# EAGLE design controller17 (EAGLE 9.5.2)

## Sheet 1 of 2
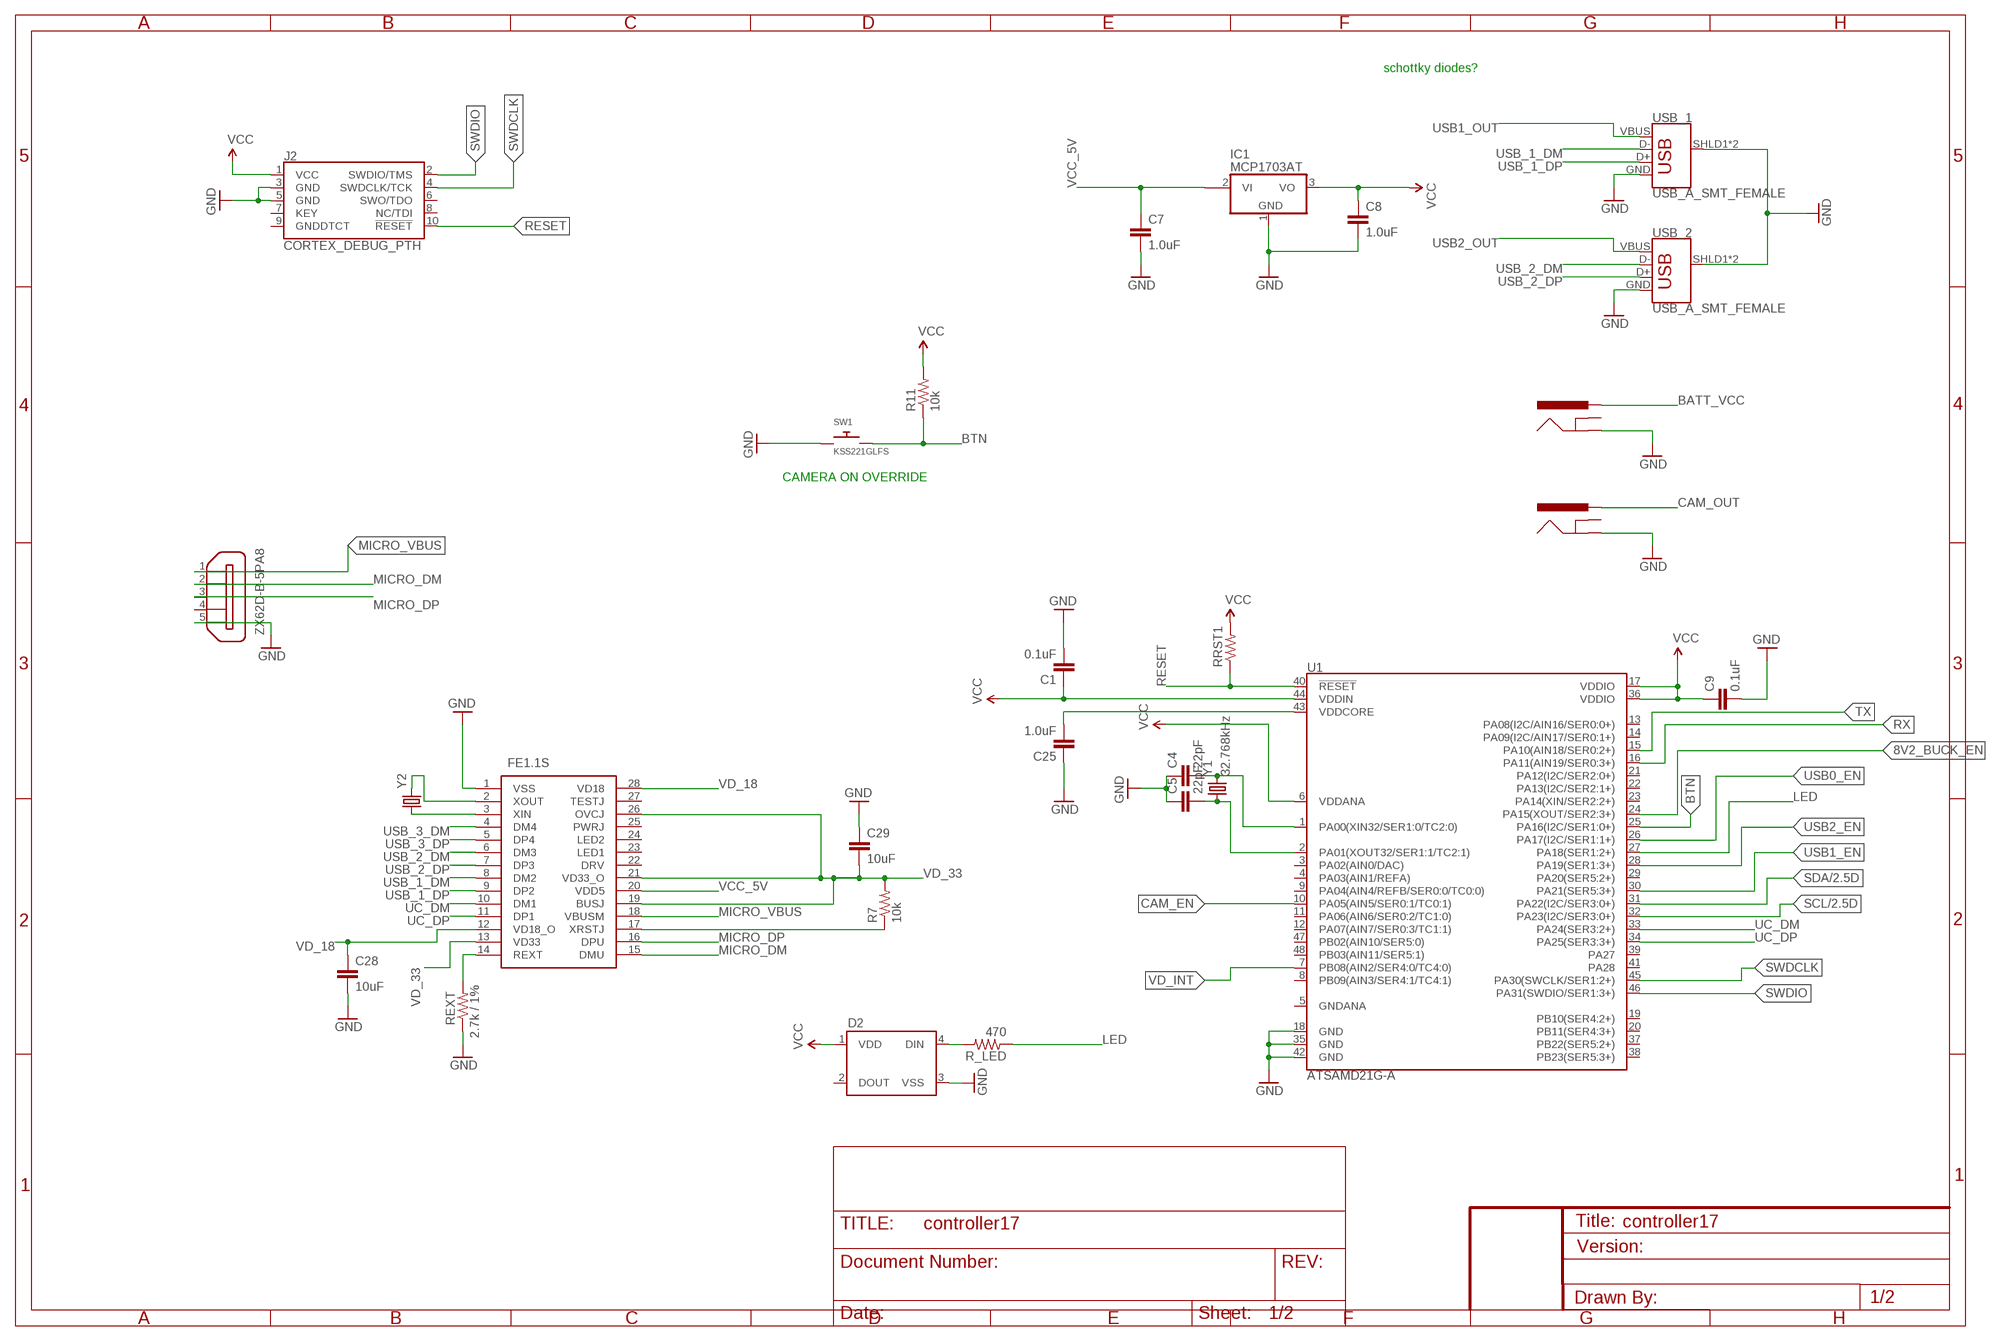
[diagram p0: schematic, sheet 1]

### Parts
C1  0.1uF  1.0UF-0805-25V-10%  [0805]
C4  22pF  CAP0805  [0805]
C5  22pF  CAP0805  [0805]
C7  1.0uF  1.0UF-0805-25V-10%  [0805]
C8  1.0uF  1.0UF-1206-50V-10%  [1206]
C9  0.1uF  1.0UF-0805-25V-10%  [0805]
C25  1.0uF  1.0UF-0805-25V-10%  [0805]
C28  10uF  1.0UF-0805-25V-10%  [0805]
C29  10uF  1.0UF-0805-25V-10%  [0805]
D2  WS2812B  [WS2812B]
IC1  MCP1703AT  MCP170312MB  [SOT89]
IC3  FE1.1S  [SOP64P600X175-28N]
J2  CORTEX_DEBUG_PTH  [2X5-PTH-1.27MM]
J3  POWER_JACKPTH_BREAD  [POWER_JACK_PTH_BREAD]
J4  POWER_JACKPTH_BREAD  [POWER_JACK_PTH_BREAD]
R7  10k  RESISTOR0805-RES  [0805]
R11  10k  RESISTOR0805-RES  [0805]
R_LED  470  RESISTOR0805-RES  [0805]
REXT  2.7k / 1%  RESISTOR0805-RES  [0805]
RRST1  RESISTOR0805-RES  [0805]
SW1  KSS221GLFS  SWITCH_PUSHBUTTONC&K_KSS  [BTN_CK_KSS]
U1  ATSAMD21G-A  [TQFP-48]
USB_1  USB_A_SMT_FEMALE  [USB-A-S-SILK-FEMALE]
USB_2  USB_A_SMT_FEMALE  [USB-A-S-SILK-FEMALE]
X2  ZX62D-B-5PA8  [ZX62D-B-5PA8]
Y1  32.768kHz  CRYSTAL3.2X1.5MM  [CRYSTAL-SMD-3.2X1.5MM]
Y2  12MHz  CRYSTALCRYSTAL-SMD-5X3-12MHZ  [CRYSTAL-SMD-5X3]

### Nets
8V2_BUCK_EN: U1.24(PA15(XOUT/SER2:3+)) ; also sheet 2
BATT_VCC [hub_power]: J4.PWR ; also sheet 2
BTN: R11.1 SW1.P$2 U1.25(PA16(I2C/SER1:0+))
CAM_EN: U1.10(PA05(AIN5/SER0:1/TC0:1)) ; also sheet 2
CAM_OUT [power]: J3.PWR ; also sheet 2
GND: C1.2 C4.1 C5.1 C7.2 C8.2 C9.2 C25.1 C28.2 C29.1 D2.3(VSS) IC1.1(GND) IC3.1(VSS) J2.3(GND) J2.5(GND) J3.GND J4.GND REXT.1 SW1.P$1 U1.18(GND) U1.35(GND) U1.42(GND) USB_1.GND USB_1.SHLD1(SHIELD) USB_1.SHLD2(SHIELD) USB_2.GND USB_2.SHLD1(SHIELD) USB_2.SHLD2(SHIELD) X2.5 ; also sheet 2
LED: R_LED.1 U1.27(PA18(SER1:2+))
MICRO_DM: IC3.15(DMU) X2.2
MICRO_DP: IC3.16(DPU) X2.3
MICRO_VBUS: IC3.18(VBUSM) X2.1 ; also sheet 2
N$5: C25.2 U1.43(VDDCORE)
N$7: D2.4(DIN) R_LED.2
N$8: C4.2 U1.1(PA00(XIN32/SER1:0/TC2:0)) Y1.P$2
N$15: IC3.17(XRSTJ) R7.1
N$23: IC3.3(XIN) Y2.1
N$24: IC3.2(XOUT) Y2.3
N$31: IC3.14(REXT) REXT.2
N$32: C5.2 U1.2(PA01(XOUT32/SER1:1/TC2:1)) Y1.P$1
RESET: J2.10(!RESET) RRST1.1 U1.40(!RESET!)
RX: U1.16(PA11(AIN19/SER0:3+))
SCL: U1.32(PA23(I2C/SER3:0+)) ; also sheet 2
SDA: U1.31(PA22(I2C/SER3:0+)) ; also sheet 2
SWDCLK: J2.4(SWDCLK/TCK) U1.45(PA30(SWCLK/SER1:2+))
SWDIO: J2.2(SWDIO/TMS) U1.46(PA31(SWDIO/SER1:3+))
TX: U1.15(PA10(AIN18/SER0:2+))
UC_DM: IC3.10(DM1) U1.33(PA24(SER3:2+))
UC_DP: IC3.11(DP1) U1.34(PA25(SER3:3+))
USB0_EN: U1.26(PA17(I2C/SER1:1+)) ; also sheet 2
USB1_EN: U1.30(PA21(SER5:3+)) ; also sheet 2
USB1_OUT: USB_1.VBUS ; also sheet 2
USB2_EN: U1.28(PA19(SER1:3+)) ; also sheet 2
USB2_OUT: USB_2.VBUS ; also sheet 2
USB_1_DM: IC3.8(DM2) USB_1.D-
USB_1_DP: IC3.9(DP2) USB_1.D+
USB_2_DM: IC3.6(DM3) USB_2.D-
USB_2_DP: IC3.7(DP3) USB_2.D+
USB_3_DM: IC3.4(DM4)
USB_3_DP: IC3.5(DP4)
VCC [power]: C1.1 C8.1 C9.1 D2.1(VDD) IC1.3(VO) J2.1(VCC) R11.2 RRST1.2 U1.6(VDDANA) U1.17(VDDIO) U1.36(VDDIO) U1.44(VDDIN) ; also sheet 2
VCC_5V [power]: C7.1 IC1.2@1(VI1) IC3.20(VDD5) ; also sheet 2
VD_18: C28.1 IC3.12(VD18_O) IC3.28(VD18)
VD_33: C29.2 IC3.13(VD33) IC3.19(BUSJ) IC3.21(VD33_O) IC3.26(OVCJ) R7.2
VD_INT: U1.7(PB08(AIN2/SER4:0/TC4:0)) ; also sheet 2
Unconnected: D2.2(DOUT) IC1.2(VI) IC3.22(DRV) IC3.23(LED1) IC3.24(LED2) IC3.25(PWRJ) IC3.27(TESTJ) J2.6(SWO/TDO) J2.7(KEY) J2.8(NC/TDI) J2.9(GNDDTCT) J3.GNDBREAK J4.GNDBREAK U1.3(PA02(AIN0/DAC)) U1.4(PA03(AIN1/REFA)) U1.5(GNDANA) U1.8(PB09(AIN3/SER4:1/TC4:1)) U1.9(PA04(AIN4/REFB/SER0:0/TC0:0)) U1.11(PA06(AIN6/SER0:2/TC1:0)) U1.12(PA07(AIN7/SER0:3/TC1:1)) U1.13(PA08(I2C/AIN16/SER0:0+)) U1.14(PA09(I2C/AIN17/SER0:1+)) U1.19(PB10(SER4:2+)) U1.20(PB11(SER4:3+)) U1.21(PA12(I2C/SER2:0+)) U1.22(PA13(I2C/SER2:1+)) U1.23(PA14(XIN/SER2:2+)) U1.29(PA20(SER5:2+)) U1.37(PB22(SER5:2+)) U1.38(PB23(SER5:3+)) U1.39(PA27) U1.41(PA28) U1.47(PB02(AIN10/SER5:0)) U1.48(PB03(AIN11/SER5:1)) X2.4 X2.S1 X2.S2 X2.S3 X2.S4

### Notes on the sheet
- schottky diodes?
- CAMERA ON OVERRIDE

## Sheet 2 of 2
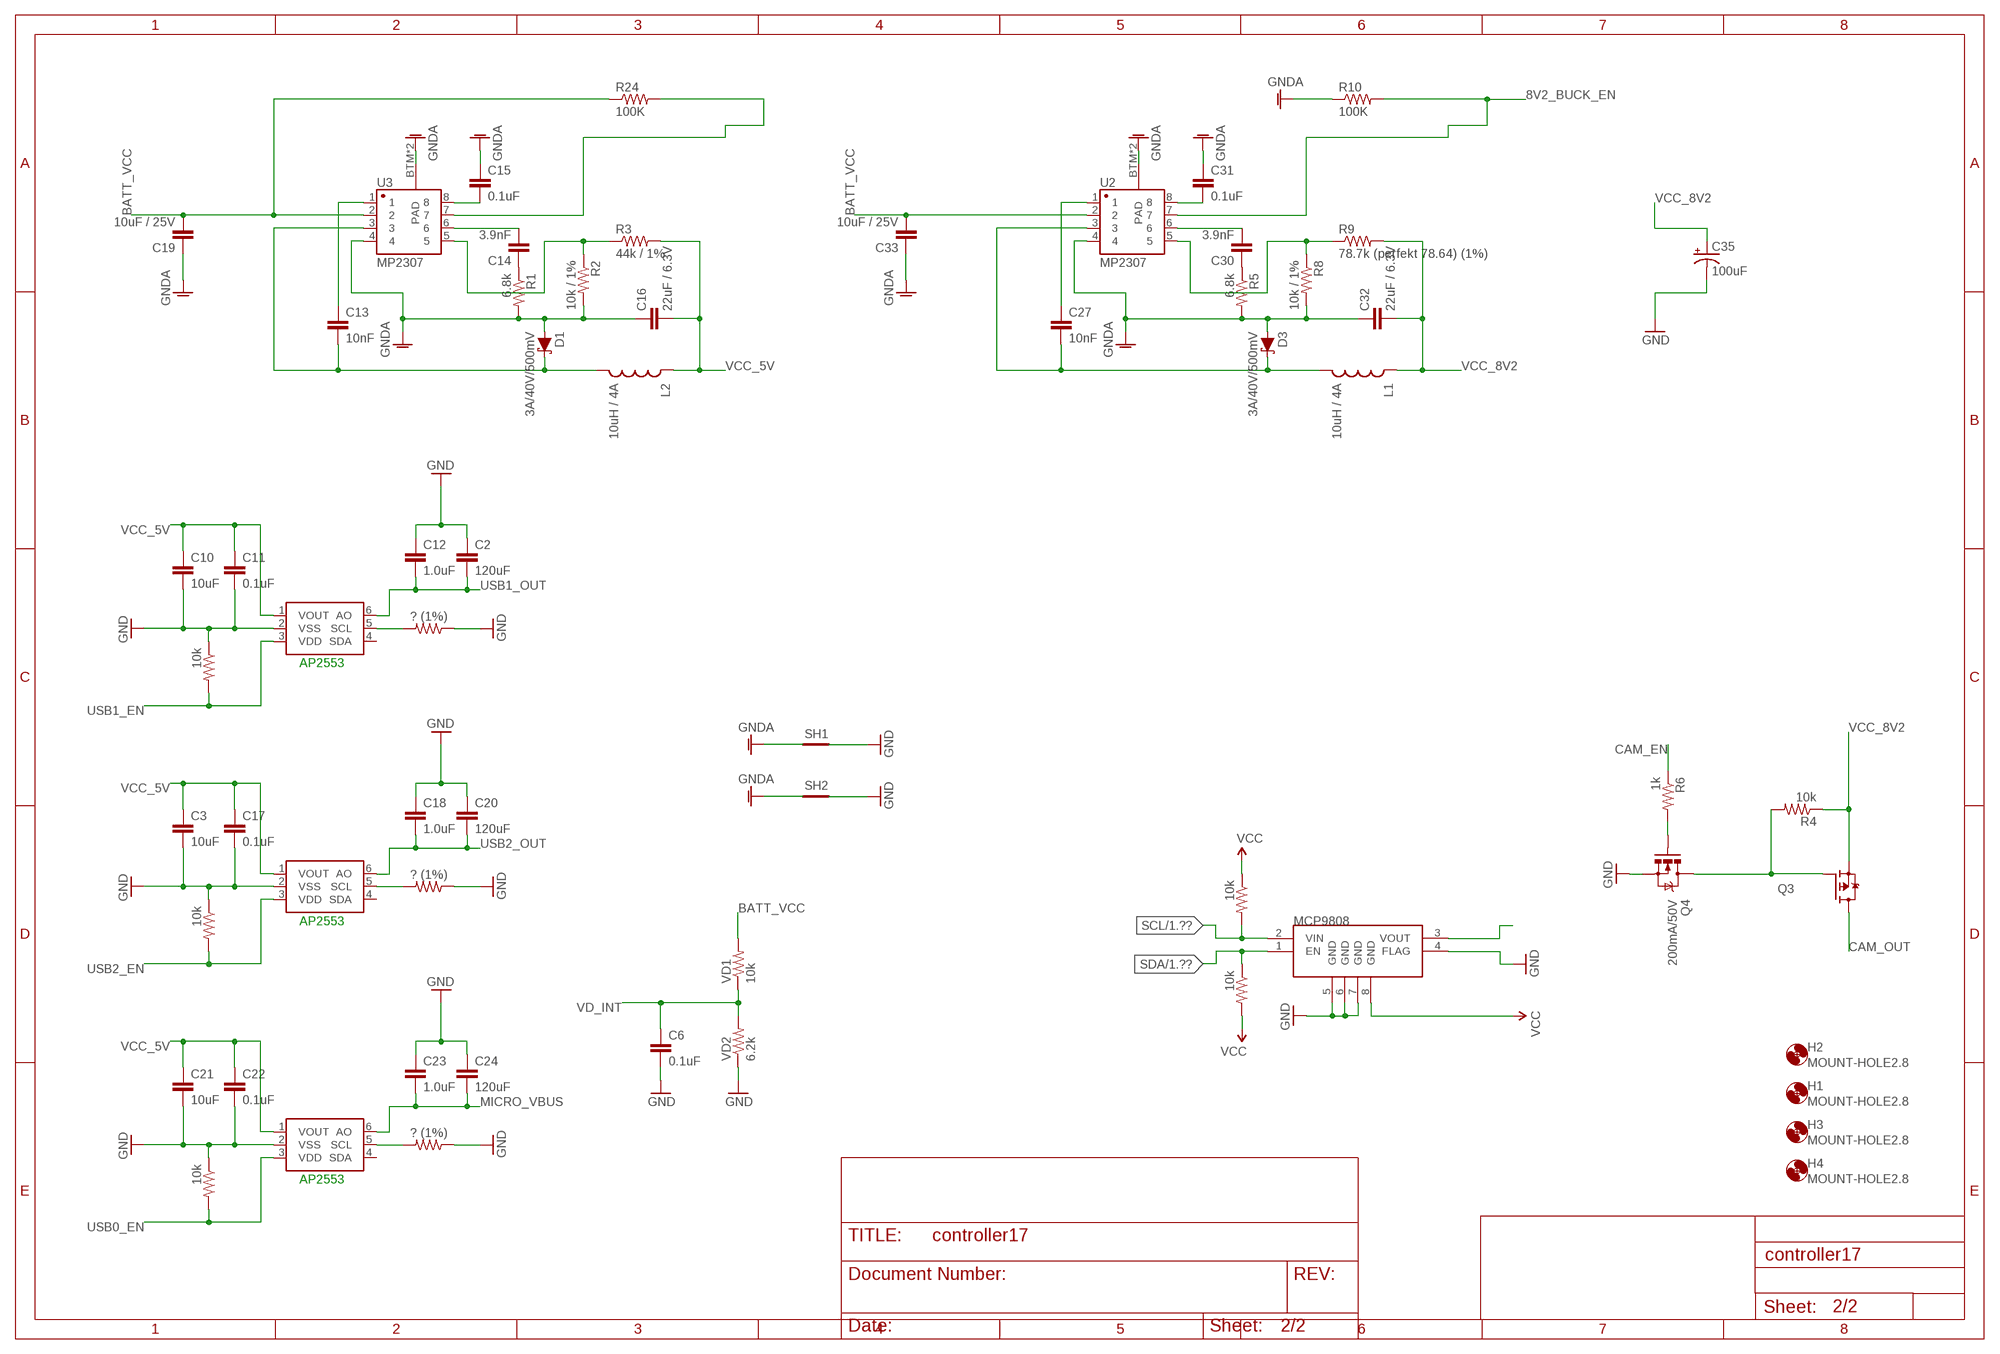
[diagram p1: schematic, sheet 2]

### Parts
AP1  MCP4725  MCP4725SOT-23  [SOT23-6]
AP2  MCP4725  MCP4725SOT-23  [SOT23-6]
AP2553  MCP4725  MCP4725SOT-23  [SOT23-6]
C2  120uF  1.0UF-1206-50V-10%  [1206]
C3  10uF  1.0UF-1206-50V-10%  [1206]
C6  0.1uF  CAP1206  [1206]
C10  10uF  1.0UF-1206-50V-10%  [1206]
C11  0.1uF  1.0UF-0805-25V-10%  [0805]
C12  1.0uF  1.0UF-0805-25V-10%  [0805]
C13  10nF  CAP1206  [1206]
C14  3.9nF  CAP1206  [1206]
C15  0.1uF  CAP1206  [1206]
C16  22uF / 6.3V  CAP1210  [1210]
C17  0.1uF  1.0UF-0805-25V-10%  [0805]
C18  1.0uF  1.0UF-1206-50V-10%  [1206]
C19  10uF / 25V  CAP1210  [1210]
C20  120uF  1.0UF-1206-50V-10%  [1206]
C21  10uF  1.0UF-1206-50V-10%  [1206]
C22  0.1uF  1.0UF-0805-25V-10%  [0805]
C23  1.0uF  1.0UF-1206-50V-10%  [1206]
C24  120uF  1.0UF-1206-50V-10%  [1206]
C27  10nF  CAP1206  [1206]
C30  3.9nF  CAP1206  [1206]
C31  0.1uF  CAP1206  [1206]
C32  22uF / 6.3V  CAP1210  [1210]
C33  10uF / 25V  CAP1210  [1210]
C35  100uF  100UF-POLAR-25V-20%(ELEC)  [PANASONIC_D]
D1  3A/40V/500mV  DIODE-SCHOTTKY-B340A  [SMA-DIODE]
D3  3A/40V/500mV  DIODE-SCHOTTKY-B340A  [SMA-DIODE]
H1  MOUNT-HOLE2.8  [2,8]
H2  MOUNT-HOLE2.8  [2,8]
H3  MOUNT-HOLE2.8  [2,8]
H4  MOUNT-HOLE2.8  [2,8]
L1  10uH / 4A  INDUCTORSRU1038  [SRU1038]
L2  10uH / 4A  INDUCTORSRU1038  [SRU1038]
MCP9808  V_REG_MIC5216  [MSOP8]
Q3  FDD4141TO252  [TO252]
Q4  200mA/50V  MOSFET-NCHANNELBSS138  [SOT23-3]
R1  6.8k  RESISTOR1206  [1206]
R2  10k / 1%  RESISTOR1206  [1206]
R3  44k / 1%  RESISTOR1206  [1206]
R4  10k  RESISTOR0805-RES  [0805]
R5  6.8k  RESISTOR1206  [1206]
R6  1k  RESISTOR0805-RES  [0805]
R8  10k / 1%  RESISTOR1206  [1206]
R9  78.7k (perfekt 78.64) (1%)  RESISTOR1206  [1206]
R10  100K  RESISTOR1206  [1206]
R24  100K  RESISTOR1206  [1206]
R_I2C_1  10k  RESISTOR0805-RES  [0805]
R_I2C_2  10k  RESISTOR0805-RES  [0805]
R_MOSFET_USB1  ? (1%)  RESISTOR0805-RES  [0805]
R_MOSFET_USB2  ? (1%)  RESISTOR0805-RES  [0805]
R_MOSFET_USB3  10k  RESISTOR0805-RES  [0805]
R_MOSFET_USB4  10k  RESISTOR0805-RES  [0805]
R_MOSFET_USB5  ? (1%)  RESISTOR0805-RES  [0805]
R_MOSFET_USB6  10k  RESISTOR0805-RES  [0805]
SH1  SHORT-HT5  [SHORT_TOP-50]
SH2  SHORT-HT5  [SHORT_TOP-50]
U2  MP2307  GENERIC-SOIC8MSGEQ7N-FILTER  [SO08]
U3  MP2307  GENERIC-SOIC8MSGEQ7N-FILTER  [SO08]
VD1  10k  RESISTOR1206  [1206]
VD2  6.2k  RESISTOR1206  [1206]

### Nets
8V2_BUCK_EN: R10.2 U2.7 ; also sheet 1
BATT_VCC [hub_power]: C19.2 C33.2 R24.1 U2.2 U3.2 VD1.2 ; also sheet 1
CAM_EN: R6.1 ; also sheet 1
CAM_OUT [power]: Q3.3(D) ; also sheet 1
GND: AP1.2(VSS) AP2.2(VSS) AP2553.2(VSS) C2.1 C3.2 C6.2 C10.2 C11.2 C12.1 C17.2 C18.1 C20.1 C21.2 C22.2 C23.1 C24.1 C35.- MCP9808.4(FLAG) MCP9808.5(GND) MCP9808.6(GND) MCP9808.7(GND) Q4.2(S) R_MOSFET_USB1.1 R_MOSFET_USB2.1 R_MOSFET_USB3.1 R_MOSFET_USB4.1 R_MOSFET_USB5.1 R_MOSFET_USB6.1 SH1.2 SH2.2 VD2.1 ; also sheet 1
GNDA [power]: C15.1 C16.1 C19.1 C31.1 C32.1 C33.1 D1.A D3.A R1.2 R2.2 R5.2 R8.2 R10.1 SH1.1 SH2.1 U2.4 U2.BTM(PAD) U2.P$1(PAD) U3.4 U3.BTM(PAD) U3.P$1(PAD)
MICRO_VBUS: AP2.6(AO) C23.2 C24.2 ; also sheet 1
N$1: C31.2 U2.8
N$2: Q4.1(G) R6.2
N$3: Q3.1(G) Q4.3(D) R4.2
N$4: MCP9808.3(VOUT)
N$6 [power]: C27.2 D3.C L1.2 U2.3
N$9: AP2553.5(SCL) R_MOSFET_USB1.2
N$10: AP1.5(SCL) R_MOSFET_USB2.2
N$11: AP2.5(SCL) R_MOSFET_USB5.2
N$12: C27.1 U2.1
N$13: C30.1 R5.1
N$14: C30.2 U2.6
N$16: R8.1 R9.1 U2.5
N$25: C15.2 U3.8
N$26 [power]: C13.2 D1.C L2.2 U3.3
N$27: C13.1 U3.1
N$28: C14.1 R1.1
N$29: C14.2 U3.6
N$30: R2.1 R3.1 U3.5
PB_BUCK_EN: R24.2 U3.7
SCL: MCP9808.2(VIN) R_I2C_1.2 ; also sheet 1
SDA: MCP9808.1(EN) R_I2C_2.1 ; also sheet 1
USB0_EN: AP2.3(VDD) R_MOSFET_USB6.2 ; also sheet 1
USB1_EN: AP2553.3(VDD) R_MOSFET_USB3.2 ; also sheet 1
USB1_OUT: AP2553.6(AO) C2.2 C12.2 ; also sheet 1
USB2_EN: AP1.3(VDD) R_MOSFET_USB4.2 ; also sheet 1
USB2_OUT: AP1.6(AO) C18.2 C20.2 ; also sheet 1
VCC [power]: MCP9808.8(GND) R_I2C_1.1 R_I2C_2.2 ; also sheet 1
VCC_5V [power]: AP1.1(VOUT) AP2.1(VOUT) AP2553.1(VOUT) C3.1 C10.1 C11.1 C16.2 C17.1 C21.1 C22.1 L2.1 R3.2 ; also sheet 1
VCC_8V2 [power]: C32.2 C35.+ L1.1 Q3.2(S) R4.1 R9.2
VD_INT: C6.1 VD1.1 VD2.2 ; also sheet 1
Unconnected: AP1.4(SDA) AP2.4(SDA) AP2553.4(SDA)

### Notes on the sheet
- AP2553
- AP2553
- AP2553

## Library data of the parts
AP1 AP2 AP2553 = SparkFun-IC-Conversion:MCP4725: MCP4725 DAC Microchip 12-bit I2C DAC, SOT23-6 Datasheet <https://cdn.sparkfun.com/datasheets/BreakoutBoards/MCP4725_2009.pdf> SparkFun Products SparkFun I2C DAC Breakout - MCP4725 <https://www.sparkfun.com/products/12918> (BOB-12918); PROD_ID: IC-08886
C1 C9 C11 C17 C22 C28 C29 = SparkFun-Capacitors:1.0UF: 1µF ceramic capacitors A capacitor is a passive two-terminal electrical component used to store electrical energy temporarily in an electric field.; PROD_ID: CAP-08064; VALUE: 1.0uF
C2 C3 C10 C20 C21 C24 = SparkFun-Capacitors:1.0UF: 1µF ceramic capacitors A capacitor is a passive two-terminal electrical component used to store electrical energy temporarily in an electric field.; PROD_ID: CAP-09822; VALUE: 1.0uF
C4 C5 = SparkFun-Passives:CAP: Capacitor Standard 0603 ceramic capacitor, and 0.1" leaded capacitor.
C6 C13-C16 C19 C27 C30-C33 = SparkFun-Capacitors:CAP: Capacitor Standard 0603 ceramic capacitor, and 0.1" leaded capacitor.
C7 C12 C25 = SparkFun-Capacitors:1.0UF: 1µF ceramic capacitors A capacitor is a passive two-terminal electrical component used to store electrical energy temporarily in an electric field.; PROD_ID: CAP-08064
C8 C18 C23 = SparkFun-Capacitors:1.0UF: 1µF ceramic capacitors A capacitor is a passive two-terminal electrical component used to store electrical energy temporarily in an electric field.; PROD_ID: CAP-09822
C35 = SparkFun-Capacitors:100UF-POLAR: 100µF polarized capacitors A capacitor is a passive two-terminal electrical component used to store electrical energy temporarily in an electric field.; PROD_ID: CAP-12547
D1 D3 = SparkFun-DiscreteSemi:DIODE-SCHOTTKY: Schottky diode A Schottky diode is a semiconductor diode which has a low forward voltage drop and a very fast switching action.; PROD_ID: DIO-09886
D2 = SparkFun-LED:WS2812B: WS2812B - Intelligent control LED integrated light source Technical Specifications: Power Supply Voltage (VDD): 3.5 to 5.3 V Input Voltage (VI): -0.5 to VDD+0.5 V Operating Junction Temperature (Topt): -25°C to +80°C Storage Temperature Range (Tstg): -55°C to +150°C; PROD_ID: DIO-12503
H1-H4 = holes:MOUNT-HOLE: MOUNTING HOLE with drill center marker
IC1 = linear:MCP1703*: 250 mA, 16V, Low Quiescent Current LDO Regulator Source: http://ww1.microchip.com/downloads/en/DeviceDoc/22049b.pdf
IC3 = FE1.1S:FE1.1S: USB 2.0 HIGH SPEED 4-PORT HUB CONTROLLER Source: Datasheet <https://cdn-shop.adafruit.com/product-files/2991/FE1.1s Data Sheet (Rev. 1.0).pdf>; DESCRIPTION: USB 2.0 HIGH SPEED 4-PORT HUB CONTROLLER; HEIGHT: 1.75mm; MANUFACTURER_NAME: JFD IC; MANUFACTURER_PART_NUMBER: FE1.1S
J2 = SparkFun-Connectors:CORTEX_DEBUG: Cortex Debug Connector - 10 pin Supports JTAG debug, Serial Wire debug, and Serial Wire Viewer. PTH and SMD connector options available. General Connector Information <http://infocenter.arm.com/help/topic/com.arm.doc.faqs/attached/13634/cortex_debug_connectors.pdf> Products: PTH Connector <http://www.digikey.com/product-detail/en/cnc-tech/3220-10-0100-00/1175-1627-ND/3883661> -via Digi-Key SparkFun PSoc <https://www.sparkfun.com/products/13229> SparkFun T <https://www.sparkfun.com/products/13810>
J3 J4 = SparkFun-Connectors:POWER_JACK: Power Jack Connector This is the standard 5.5mm barrel jack for power. The PTH is the most common, proven, reliable, footprint. The Slot footprint only works if the mill layer is transmitted to the PCB fab house so be warned. Here are the connectors we sell at SparkFun: DC Barrel Power Jack/Connector <https://www.sparkfun.com/products/119> (PRT-00119) DC Barrel Power Jack/Connector (SMD) <https://www.sparkfun.com/products/12748> (PRT-12748) DC Barrel Jack Adapter - Breadboard Compatible <https://www.sparkfun.com/products/10811> (PRT-10811) It is used on this SparkFun product (and many, many others): SparkFun RedBoard - Programmed with Arduino <https://www.sparkfun.com/products/12757> (DEV-12757) Also, if you need a mating power supply or connector, please check these out: Wall Adapter Power Supply - 9VDC 650mA <https://www.sparkfun.com/products/298> (TOL-00298) DC Barrel Jack Adapter - Male <https://www.sparkfun.com/products/10287> (PRT-10287); PROD_ID: PRT-10811
L1 L2 = SparkFun-Passives:INDUCTOR: Inductors Basic Inductor/Choke - 0603 and 1206. Footprints are not proven and vary greatly between part numbers. INDUCTOR POWER 3.3UH 4.0A SMD 0.197" L x 0.197" W x 0.177" H (5.00mm x 5.00mm x 4.50mm)
MCP9808 = SparkFun-IC-Power:V_REG_MIC5216: 500mA LDO, MSOP8 for better dissipation; PROD_ID: IC-09527
Q3 = transistor-fet:FDD4141: P-Channel PowerTrench® MOSFET Source: FDD4141.pdf
Q4 = SparkFun-DiscreteSemi:MOSFET-NCHANNEL: Common NMOSFET Parts MFG P/N Store ID Prod ID FDD8780 TRANS-09984 SI7820DN TRANS-11055 FDS6630A IC-08089 2N7002PW TRANS-11151 FQP30N06L COM-10213 TRANS-10060 BSS123LT1G TRANS-08345 BSS138 TRANS-00830 BS170 2N7000; PROD_ID: TRANS-00830
R1-R6 R8-R10 R24 R_LED = SparkFun-Resistors:RESISTOR: Resistor Basic schematic elements and footprints for 0603, 1206, and PTH resistors.
R7 R11 R_I2C_1 R_I2C_2 R_MOSFET_USB1-R_MOSFET_USB6 REXT RRST1 VD1 VD2 = SparkFun-Passives:RESISTOR: Resistor Basic schematic elements and footprints for 0603, 1206, and PTH resistors.
SH1 SH2 = shorts:SHORT-H: Short between two nets; BOM: no
SW1 = adafruit:SWITCH_PUSHBUTTON: Buttons SOFTTOUCHSMD_SJ - Soft touch temporary push button (Super Junk Akihabara) Compatible with SKPMANE010 [Mouser: 688-SKPMAN] C&K_KSS = Digikey: KSS221GLFS
U1 = SparkFun-IC-Microcontroller:ATSAMD21G: Atmel SAMD21G SMART ARM-Based Microcontroller The Atmel ® | SMART ™ SAM D21 is a series of low-power microcontrollers using the 32-bit ARM ® Cortex ® -M0+ processor, and ranging from 32- to 64-pins with up to 256KB Flash and 32KB of SRAM. The SAM D21 devices operate at a maximum frequency of 48MHz and reach 2.46 CoreMark/MHz. They are designed for simple and intuitive migration with identical peripheral modules, hex compatible code, identical linear address map and pin compatible migration paths between all devices in the product series. All devices include intelligent and flexible peripherals, Atmel Event System for inter-peripheral signaling, and support for capacitive touch button, slider and wheel user interfaces. Datasheet <https://cdn.sparkfun.com/datasheets/Dev/Arduino/Boards/Atmel-42181-SAM-D21_Datasheet.pdf> SparkFun Products SparkFun SAMD21 Mini Breakout <https://www.sparkfun.com/products/13664> (DEV-13664) SparkFun SAMD21 Dev Breakout <https://www.sparkfun.com/products/13672> (DEV-13672); PROD_ID: IC-13064
U2 U3 = SparkFun-AnalogIC:GENERIC-SOIC8: A placeholder for generic narrow & wide SOIC8 foorptints - used on the DIP adapter board.; PROD_ID: IC-10141
USB_1 USB_2 = SparkFun-Connectors:USB_A: USB-A Connector Male and female variants, as well as PTH and SMT variants SparkFun Products: SparkFun XBee Explorer Dongle <https://www.sparkfun.com/products/11697> PTH Male SparkFun MicroView-USB Programmer <https://www.sparkfun.com/products/12924> SMT Male SparkFun USB Type A Female Breakout <https://www.sparkfun.com/products/12700> SMT Female; PROD_ID: CONN-09520; SF_ID: PRT-09011
X2 = zx62d-b-5pa8-oshpark_10:ZX62D-B-5PA8: Micro USB Type B Connector - Standard, Shell Through Hole Source: http://www.hirose.co.jp/cataloge_hp/ed_ZX_20140804.pdf; MF: Hirose; MPN: ZX62D-B-5PA8; OC_FARNELL: 2300438; OC_NEWARK: 69W0712
Y1 = SparkFun-FreqCtrl:CRYSTAL: Various standard crystals. Proven footprints.; PROD_ID: XTAL-13062
Y2 = SparkFun-FreqCtrl:CRYSTAL: Various standard crystals. Proven footprints.; PROD_ID: XTAL-08297

## Net classes
0 default: width 0.254 mm, clearance 0.152 mm
1 power: width 0.254 mm, clearance 0.254 mm
2 hub_power: width 0.584 mm, clearance 0.254 mm
3 usbsignal: width 0.254 mm, clearance 0.203 mm
4 highpower: clearance 0.305 mm

## Board
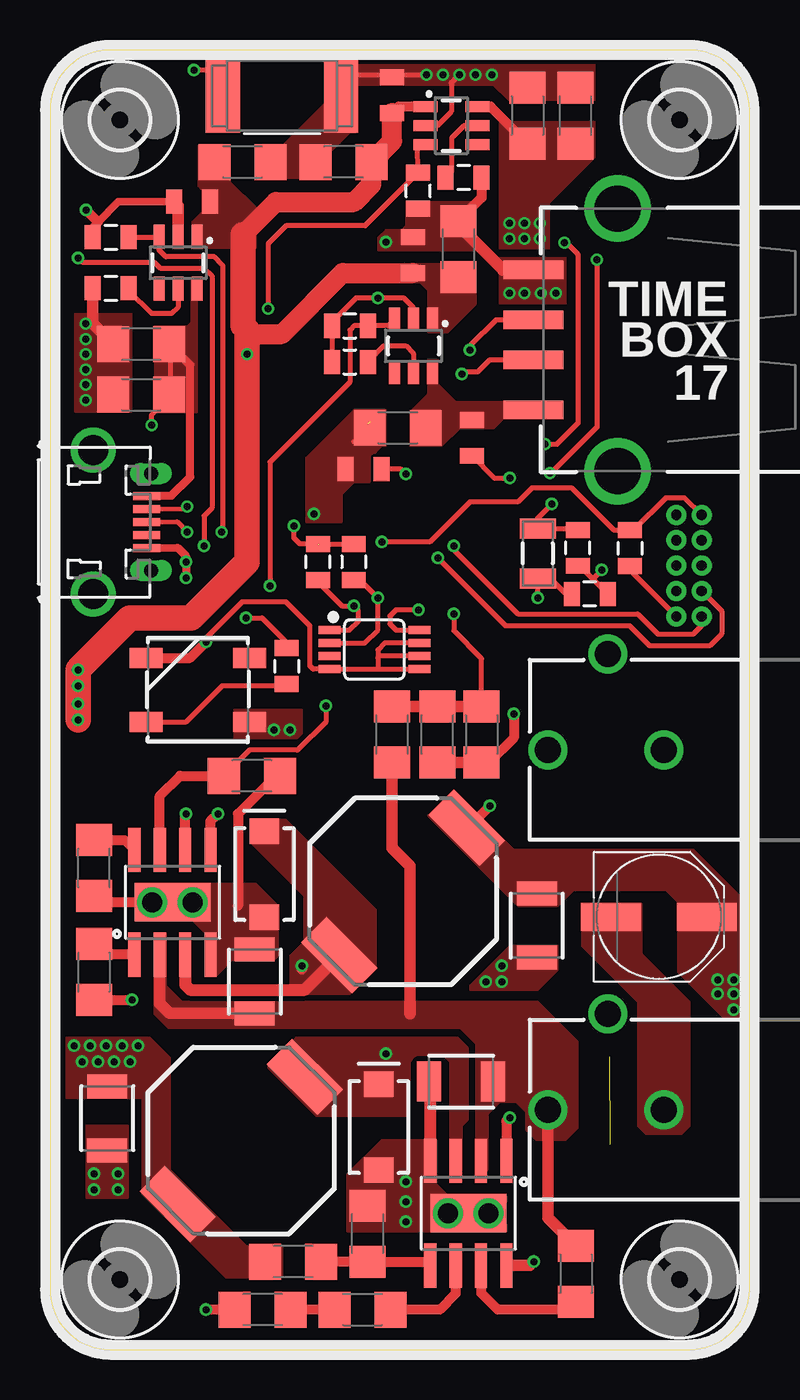
[diagram p2: board, top side]
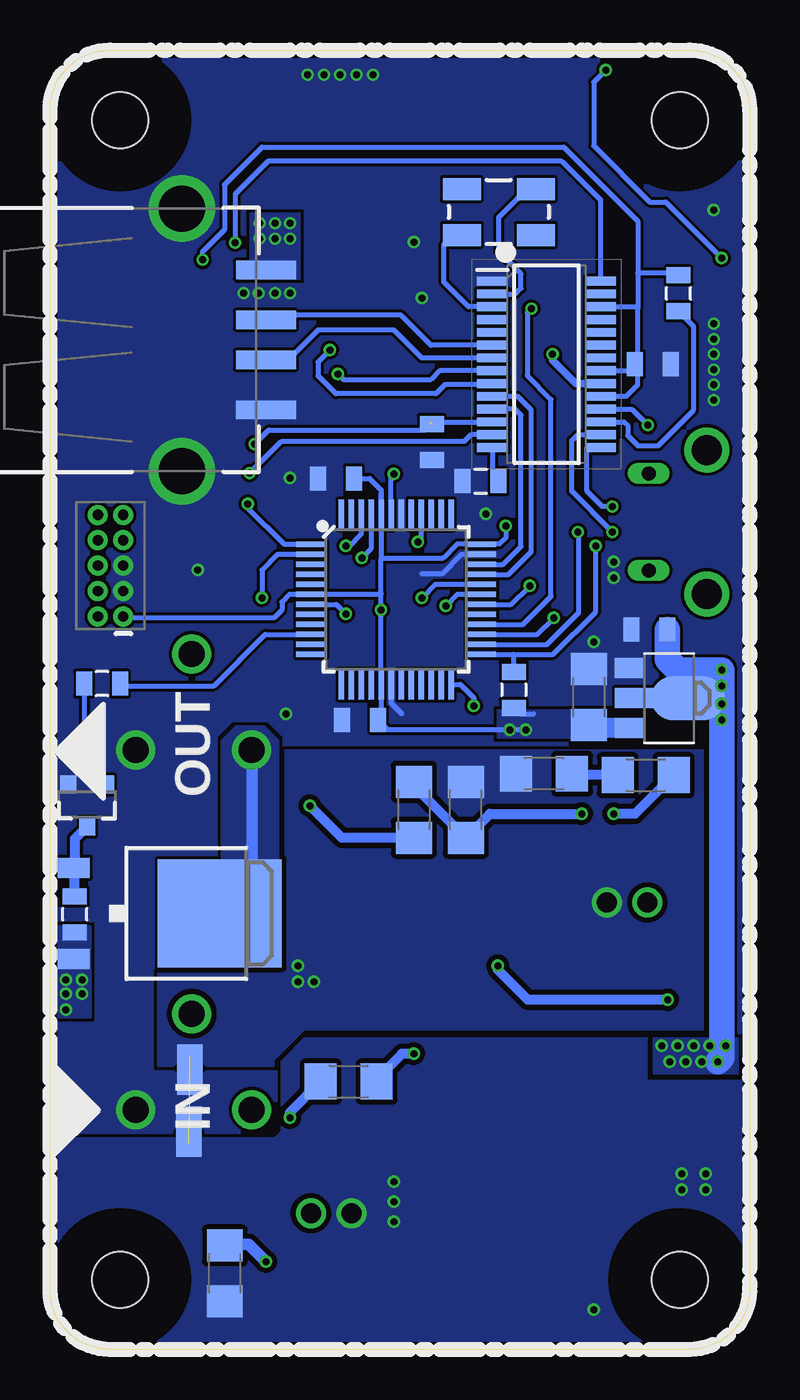
[diagram p3: board, bottom side, seen from below]

Size 35 x 65 mm. Coordinates in mm from the lower left corner, seen from the top.
Outline: 32,65 3,65 arc90 0,62 0,3 arc90 3,0 32,0 arc90 35,3 35,62 arc90 32,65
Copper layers (1*16): Top 0.035559375mm / dielectric 1.6mm / Bottom 0.035559375mm
Design rules "oshpark-2layer": minimum track width 6mil, minimum drill 10mil, track to track 6mil, track to pad 6mil, pad to pad 6mil, via to via 6mil, smd to smd 6mil, copper to edge 15mil, drill to drill 6mil, minimum pad ring 5mil, minimum via ring 5mil, stop-mask expansion 2.5mil, vias tented up to drill 0mil, thermal gap 10mil

### Footprints (pad centres in the part's own frame; a part is rotated, then mirrored left to right if it is on the bottom)
SOT23-6 = smd 0.55 x 1.2: 1 0.95,1.3; 2 0,1.3; 3 -0.95,1.3; 4 -0.95,-1.3; 5 0,-1.3; 6 0.95,-1.3
0805 = smd 0.8 x 1.2: 1 -0.9,0; 2 0.9,0
1206 = smd 1.6 x 1.8: 1 -1.4,0; 2 1.4,0
1210 = smd 1.2 x 2: 1 -1.6,0; 2 1.6,0
PANASONIC_D = smd 3 x 1.4: + 2.4,0; - -2.4,0
SMA-DIODE = smd 1.27 x 1.47: A -2.15,0; C 2.15,0
WS2812B = smd 1.651 x 1: 1 -2.577,1.6; 2 -2.577,-1.6; 3 2.577,-1.6; 4 2.577,1.6
2,8 = hole 2.8: 0,0
SOT89 = smd 1 x 1.5: 1 -1.499,-1.981; 3 1.499,-1.981 | smd 1 x 2: 2 0,-1.727 | smd 2.2 x 3.7: 2@1 0,0.94
SOP64P600X175-28N = smd 1.525 x 0.44: 1 -2.712,4.16; 2 -2.712,3.52; 3 -2.712,2.88; 4 -2.712,2.24; 5 -2.712,1.6; 6 -2.712,0.96; 7 -2.712,0.32; 8 -2.712,-0.32; 9 -2.712,-0.96; 10 -2.712,-1.6; 11 -2.712,-2.24; 12 -2.712,-2.88; 13 -2.712,-3.52; 14 -2.712,-4.16; 15 2.712,-4.16; 16 2.712,-3.52; 17 2.712,-2.88; 18 2.712,-2.24; 19 2.712,-1.6; 20 2.712,-0.96; 21 2.712,-0.32; 22 2.712,0.32; 23 2.712,0.96; 24 2.712,1.6; 25 2.712,2.24; 26 2.712,2.88; 27 2.712,3.52; 28 2.712,4.16
2X5-PTH-1.27MM = drill 0.508 pad 1: 1 -2.54,-0.635; 2 -2.54,0.635; 3 -1.27,-0.635; 4 -1.27,0.635; 5 0,-0.635; 6 0,0.635; 7 1.27,-0.635; 8 1.27,0.635; 9 2.54,-0.635; 10 2.54,0.635
POWER_JACK_PTH_BREAD = drill 1.3: GND 0,7.9; GNDBREAK 4.8,10.7; PWR 0,13.7
SRU1038 = smd 1.8 x 3.6: 1 -4.5,0; 2 4.5,0
MSOP8 = smd 0.4 x 1.1: 1 -0.975,-2.25; 2 -0.325,-2.25; 3 0.325,-2.25; 4 0.975,-2.25; 5 0.975,2.25; 6 0.325,2.25; 7 -0.325,2.25; 8 -0.975,2.25
TO252 = smd 1 x 1.6: 1 -2.28,-4.8; 2 2.28,-4.8 | smd 5.4 x 6.2: 3 0,2.5
SOT23-3 = smd 0.8 x 0.9: 1 -0.95,-1; 2 0.95,-1; 3 0,1.1
SHORT_TOP-50 = smd 1.27 x 1.27: 1 0.635,0; 2 -0.635,0
BTN_CK_KSS = smd 1.7 x 3.7: P$1 -2.95,0; P$2 2.95,0
TQFP-48 = smd 1.5 x 0.28: 1 -4.25,2.75; 2 -4.25,2.25; 3 -4.25,1.75; 4 -4.25,1.25; 5 -4.25,0.75; 6 -4.25,0.25; 7 -4.25,-0.25; 8 -4.25,-0.75; 9 -4.25,-1.25; 10 -4.25,-1.75; 11 -4.25,-2.25; 12 -4.25,-2.75; 25 4.25,-2.75; 26 4.25,-2.25; 27 4.25,-1.75; 28 4.25,-1.25; 29 4.25,-0.75; 30 4.25,-0.25; 31 4.25,0.25; 32 4.25,0.75; 33 4.25,1.25; 34 4.25,1.75; 35 4.25,2.25; 36 4.25,2.75 | smd 0.28 x 1.5: 13 -2.75,-4.25; 14 -2.25,-4.25; 15 -1.75,-4.25; 16 -1.25,-4.25; 17 -0.75,-4.25; 18 -0.25,-4.25; 19 0.25,-4.25; 20 0.75,-4.25; 21 1.25,-4.25; 22 1.75,-4.25; 23 2.25,-4.25; 24 2.75,-4.25; 37 2.75,4.25; 38 2.25,4.25; 39 1.75,4.25; 40 1.25,4.25; 41 0.75,4.25; 42 0.25,4.25; 43 -0.25,4.25; 44 -0.75,4.25; 45 -1.25,4.25; 46 -1.75,4.25; 47 -2.25,4.25; 48 -2.75,4.25
SO08 = smd 0.61 x 2.21: 1 -1.905,-2.616; 2 -0.635,-2.616; 3 0.635,-2.616; 4 1.905,-2.616; 5 1.905,2.616; 6 0.635,2.616; 7 -0.635,2.616; 8 -1.905,2.616 | smd 3.81 x 1.93: BTM 0,0 | drill 1: P$1 1.016,0; P$2 -1.016,0
USB-A-S-SILK-FEMALE = smd 3 x 0.9: D+ 7.212,-1; D- 7.212,1; GND 7.212,-3.5; VBUS 7.212,3.5 | drill 2.311: SHLD1 3,-6.566; SHLD2 3,6.566
ZX62D-B-5PA8 = smd 1.35 x 0.4: 1 4.825,1.3; 2 4.825,0.65; 3 4.825,0; 4 4.825,-0.65; 5 4.825,-1.3 | drill 1.5: S1 2.15,-3.6; S2 2.15,3.6 | drill 0.7 long: S3 5.05,2.425; S4 5.05,-2.425
CRYSTAL-SMD-3.2X1.5MM = smd 1 x 1.8: P$1 -1.25,0; P$2 1.25,0
CRYSTAL-SMD-5X3 = smd 1.9 x 1.1: 1 -1.85,-1.15; 2 1.85,-1.15; 3 1.85,1.15; 4 -1.85,1.15

### Placement (x,y rotation side)
AP1  20.08,61.21 90 top
AP2  6.4,54.36 0 top
AP2553  18.18,50.2 0 top
C1  20.69,43.57 180 bottom
C2  17.4,46.1 0 top
C3  14.68,59.4 180 top
C4  26.4,40.1 90 top
C5  27,37.8 180 top
C6  21.59,30.76 270 top
C7  5.01,36.01 180 bottom
C8  8.04,32.64 90 bottom
C9  19.48,31.49 180 bottom
C10  20.44,55.05 90 top
C11  18.15,54.74 90 top
C12  21.1,45.6 90 top
C13  20.06,13.4 0 bottom
C14  15.65,2 0 top
C15  26.25,3.81 90 bottom
C16  2.87,11.57 90 top
C17  17.12,62.74 90 top
C18  26.28,61.72 270 top
C19  20.57,13.41 0 top
C20  23.89,61.72 270 top
C21  9.63,59.4 0 top
C22  7.11,57.4 180 top
C23  4.57,47.75 0 top
C24  4.57,50.29 0 top
C25  15.69,44.03 0 top
C27  2.2,18.88 270 top
C28  15.89,45.4 270 bottom
C29  4.83,49.28 180 bottom
C30  5.2,28.74 0 bottom
C31  2.2,24.08 90 top
C32  24.36,21.2 90 top
C33  10.24,18.41 270 top
C35  30.46,21.65 0 top
D1  16.45,11.13 90 top
D2  7.4,33 180 top
D3  10.73,23.78 90 top
H1  31.5,3.5 0 top
H2  31.5,61.5 0 top
H3  3.5,3.5 0 top
H4  3.5,61.5 0 top
IC1  4.01,32.58 270 bottom
IC3  10.16,49.28 0 bottom
J2  31.97,39.21 90 bottom
J3  38.6,30 90 top
J4  38.6,12 90 top
L1  17.66,22.91 225 top
L2  9.57,10.46 45 top
MCP9808  16.23,35.01 270 top
Q3  29.01,21.81 270 bottom
Q4  33.15,27.26 180 bottom
R1  10.65,2 180 top
R2  15.89,5.8 90 top
R3  12.17,4.4 180 top
R4  33.76,21.77 90 bottom
R5  10.28,28.8 180 bottom
R6  32.39,33.31 180 bottom
R7  3.56,52.83 90 bottom
R8  14.2,27 90 bottom
R9  16.8,27 270 bottom
R10  10.1,28.7 180 top
R11  11.8,33 270 bottom
R24  26.32,3.79 270 top
R_I2C_1  15.2,39.4 270 top
R_I2C_2  13.4,39.4 90 top
R_LED  11.84,34.18 270 top
R_MOSFET_USB1  15,49.4 0 top
R_MOSFET_USB2  20.69,58.62 180 top
R_MOSFET_USB3  15,51.2 0 top
R_MOSFET_USB4  18.42,57.95 90 top
R_MOSFET_USB5  3.05,53.09 0 top
R_MOSFET_USB6  3.05,55.63 0 top
REXT  13.46,43.43 0 bottom
RRST1  29.02,40.08 270 top
SH1  28,14 90 bottom
SH2  28.05,10.9 270 bottom
SW1  11.6,62.7 180 top
U1  17.68,37.52 0 bottom
U2  6.13,22.37 0 top
U3  20.93,6.82 180 top
USB_1  31.4,50.5 180 top
USB_2  31.4,50.5 0 bottom
VD1  17.1,30.76 270 top
VD2  19.38,30.76 90 top
X2  0,41.4 0 top
Y1  24.4,39.82 90 top
Y2  12.54,56.9 0 bottom

### Tracks (layer width: path | path; a pad name or v marks a point on that pad's centre or on a via)
8V2_BUCK_EN  (via drill 0.35)
  Top 0.254: R10.2 9.98,29.98 12.38,29.98 13.8,31.4 v13.8,32.2
  Top 0.508: U2.7 5.5,27.7 6.5,28.7 R10.2
  Bottom 0.254: U1.24 14.47,33.27 13.8,32.6 v13.8,32.2
BATT_VCC
  Top 0.584: R24.1 24.92,6.59 24.92,11.68 24.9,11.7 J4.PWR | VD1.2 17.1,25.1 18,24.2 18,16.8 | U2.2 5.5,17.3 5.99,16.81 C33.2
  pour Top (no thermals): 21.3,9 21.9,9 21.9,11.8 22.5,12.4 23.3,12.4 23.8,11.9 23.8,11 24.3,10.5 25.8,10.5 26.4,11.1 26.4,15.4 21.5,15.4 21.3,15.2
  pour Top (no thermals): 5.8,20.8 5.2,20.8 5.2,16.8 5.9,16.1 20.5,16.1 21.8,14.8 22.4,15.4 26.4,15.4 24.4,17.4 6.6,17.4 5.8,18.2
BTN  (via drill 0.35)
  Top 0.254: SW1.P$2 8.4,62.95 8.4,64 v7.2,64 | v1.4,54.6 1.6,54.4 5.2,54.4 5.5,54.1 7.7,54.1 8.1,53.7 8.1,42.1 7.7,41.7 v7.7,40.2
  Bottom 0.254: v7.2,64 7.8,63.4 7.8,60.2 5,57.4 4.2,57.4 v1.4,54.6 | U1.25 11.8,34.77 | 11.8,34.77 9.83,34.77 7.7,36.9 v7.7,40.2 | R11.1 11.8,34.77
CAM_EN
  Bottom 0.254: R6.1 31.44,33.26 31.42,33.2 26.8,33.2 24.23,35.77 U1.10
CAM_OUT
  Bottom 0.584: J3.PWR 24.9,22.1 25.4,21.6 26.3,21.6 Q3.3
  pour Bottom (no thermals): 23.6,19.6 26.4,19.6 26.4,30.5 25.7,31.2 24.3,31.2 23.6,30.5
GND  (via drill 0.35)
  Top 0.254: AP1.2 19.38,61.21 20.08,61.91 20.08,63.35 v20.48,63.75 | SW1.P$1 14.55,63.75 v18.85,63.75 | AP2553.2 18.18,52.12 17.7,52.6 v16.4,52.6 15.3,52.6 14.1,51.4 R_MOSFET_USB3.1 R_MOSFET_USB1.1 | C5.1 27.15,38.55 | 27.15,38.55 26.5,39.2 C4.1 | C12.1 22.2,43.6 v23,43.6 | 16.4,34.03 MCP9808.4 13.17,34.03 13,34.2 13,36.2 11.8,37.4 9.6,37.4 7.8,35.6 v7.8,35.4 | 16.4,34.03 MCP9808.5 | MCP9808.7 16.73,35.33 16.4,35 16.4,34.6 | 16.4,34.6 16.4,34.03 | MCP9808.6 16.48,34.68 16.4,34.6 | 27.15,38.55 v27.6,39 | C2.1 15.3,45.4 15.2,45.4
  Top 0.381: R_MOSFET_USB6.1 2.15,56.13 2.41,56.39 3.42,57.4 C22.2
  Top 0.406: X2.5 6.38,40.1 6.8,39.68 v6.8,39.4 v6.8,38.6
  Top 0.508: R_MOSFET_USB2.1 21.59,57.6 C10.2 | 2.41,56.39 v1.8,57 | v23.2,31.8 23.2,30.6 21.96,29.36 C6.2 | v7.8,35.4 7,34.6 D2.3
  Top 0.584: C24.1 2.15,51.32 R_MOSFET_USB5.1 | C22.2 6.4,57.21 AP2.2 | VD2.1 C6.2
  Top 0.635: USB_1.GND 24.17,54.01 23.04,54.02 22.67,54.02 20.44,56.25 C10.2
  Bottom 0.254: U1.18 17.93,32.33 17.4,31.8 | U1.35 14.43,39.77 15.4,38.8 16.4,38.8
  other vias: 1.78,47.5 1.78,48.26 1.78,49.02 1.78,49.78 1.78,50.55 1.78,51.31 19.66,63.75 21.29,63.75 22.11,63.75 22.98,52.83 23.74,52.83 24.56,52.83 25.32,52.83 16.8,55.4 13.2,41.8
  pour Bottom (rank 3, no thermals): 35,0 0,0 0,65 17.56,65 35,65
  pour Top (no thermals): 4.06,46.89 1.27,46.89 1.27,51.82 4.06,51.82
  pour Top (no thermals): 13.71,63.25 22.16,63.25 22.93,62.48 27.3,62.48 27.3,64.26 13.71,64.26
  pour Top (no thermals): 22.47,54.61 22.47,52.32 25.83,52.32 25.83,54.61
  pour Top (no thermals): 29.8,10.8 31.6,10.8 32,11.2 32,17.4 29.6,19.8 29.6,22.3 26.6,22.3 26.6,20.2 29.4,17.4 29.4,11.2
  pour Top (no thermals): 10.3,58.6 14,58.6 14,59.9 15,60.9 15.3,60.9 15.3,62.3 13.7,62.3 10.3,58.9
  pour Top (no thermals): 17.8,57.4 17.8,56.2 17.6,56 16.8,56 16.4,55.6 16.4,55 21.2,55 21.2,57.4
  pour Top (no thermals): 16.8,47 15.2,47 12.8,44.6 12.8,41.4 14.6,41.4 14.6,42.8 15.2,43.4 16,43.4 16,44.6 16.6,45.2 16.8,45.2
GNDA  (via drill 0.35)  (1 unrouted)
  Top 0.254: C31.1 1.52,22.68
  Top 0.508: R1.2 v7.8,2 | U2.BTM 2.52,22.37 C31.1 | R10.1 11.3,28.7 9.4,26.8 9.4,22.2
  Top 0.6: U3.4 19.03,13.35 C19.1
  other vias: 2.2,8.8 3.4,8.8 2.2,8 3.4,8 17.8,6.4 17.8,7.4 17.8,8.4 21.8,18.4 22.6,18.4 22.6,19.2
  pour Bottom (rank 2, no thermals): 0,15.58 0,-0.13 12.5,0 35,0 35,10.6 23.74,10.6 23.39,10.93 23.39,14.45 22.25,15.58
  pour Top (no thermals): 22.8,5.9 14.88,5.9 14.88,8.78 16.6,10.5 19.3,10.5 19.3,8.3 19.9,7.7 22.8,7.7
  pour Top (no thermals): 3.9,11.2 1.8,11.2 1.8,7.6 3.9,7.6
  pour Top (no thermals): 4.3,23.3 4.3,21.5 7.1,21.5 7.8,20.8 7.8,18.7 8.3,18.7 9.1,19.5 11.2,19.5 11.4,19.7 11.4,22.2 10.3,23.3
  pour Bottom (rank 2, no thermals): 0,16 22.2,16 23.4,17.2 23.4,30 0,30
  pour Top (no thermals): 25.2,20.2 23.4,20.2 23,20.2 21,18.2 21,18 24.2,18 24.4,18 25.4,19 25.4,20.2
  pour Bottom (no thermals): 22.2,19.2 29.57,19.2 arc45 29.6,19.28 29.6,14.2 23.8,14.2 23.8,14.5 22.2,16.1
LED  (via drill 0.35)
  Top 0.254: v9.8,36.6 10.6,36.6 11.84,35.36 R_LED.1
  Bottom 0.254: U1.27 10.63,35.77 v9.8,36.6
MICRO_DM  (via drill 0.35)
  Top 0.254: X2.2 6.75,42.05 v6.86,42.16
  Bottom 0.254: v6.86,42.16 7.37,42.16 8.13,42.93 8.13,45.12 IC3.15
MICRO_DP  (via drill 0.35)
  Top 0.254: X2.3 6.35,41.4 v6.86,40.89
  Bottom 0.254: v6.86,40.89 8.89,42.93 8.89,45.47 8.6,45.76 IC3.16
MICRO_VBUS  (via drill 0.35)
  Top 0.254: v5.08,46.23 5.08,46.74 5.97,47.63 C23.2 6.03,47.81 6.03,50.23
  Top 0.406: X2.1 6.07,42.7 7.02,43.65 7.02,49.24 6.03,50.23 C24.2
  Bottom 0.254: IC3.18 5.89,47.04 v5.08,46.23
  pour Top (no thermals): 7.07,53.59 7.07,51.36 6.86,51.15 5.23,51.15 5.23,46.89 7.37,46.89 7.37,53.59
N$1
  Top 0.508: C31.2 3.73,25.48 U2.8
N$2
  Bottom 0.254: R6.2 33.29,29.35 Q4.1
N$3
  Bottom 0.508: R4.2 33.76,24.04 | 33.76,24.04 Q3.1 | Q4.3 33.76,25.55 33.76,24.04
N$5  (via drill 0.35)
  Top 0.254: v17.8,43.8 17.57,44.03 C25.2
  Bottom 0.254: U1.43 17.93,43.67 v17.8,43.8
N$6  (via drill 0.35)
  Top 0.508: C27.2 4.08,17.48 v4.1,17.5 | v12.6,19.2 12.6,19
  Top 0.6: U2.3 6.77,18.23 7,18 12.74,18 L1.2
  Bottom 0.508: v4.1,17.5 11.1,17.5 12.6,19 v12.6,19.2
  pour Top (no thermals): 15.1,17.9 16.3,19.1 16.3,22 11.8,26.5 10.1,26.5 10.1,25.3 12.7,22.7 12.7,20.4 15.1,18
  pour Top (no thermals): 12.7,20.4 12,19.7 12,17.8 15,17.8 16.3,19.1 15,20.4
N$7
  Top 0.254: D2.4 6.82,31.4 8.62,33.2 11.76,33.2 R_LED.2
N$8  (via drill 0.35)
  Top 0.254: Y1.P$2 24.5,41.07 | C4.2 26.33,41.07 24.8,41.07 24.6,41.07 Y1.P$2 | Y1.P$2 24.4,41.6 v25.1,42.3
  Bottom 0.254: U1.1 23.27,40.27 25.1,42.1 v25.1,42.3
N$9
  Top 0.254: R_MOSFET_USB1.2 16.7,50.2 17.8,50.2 18.18,49.82 AP2553.5
N$10
  Top 0.254: R_MOSFET_USB2.2 20.1,58.93 20.1,60.6 20.71,61.21 AP1.5
N$11
  Top 0.254: AP2.5 6.4,52.12 6.1,51.82 5.08,51.82 3.95,52.95 R_MOSFET_USB5.2
N$12
  Top 0.508: U2.1 2.72,19.75 C27.1
N$13
  Bottom 0.508: C30.1 8.81,28.74 R5.1
N$14  (via drill 0.35)
  Top 0.508: U2.6 6.77,26.77 v6.8,26.8
  Bottom 0.508: C30.2 5.73,26.8 v6.8,26.8
N$15
  Bottom 0.254: IC3.17 6.26,46.4 6.1,46.23 6.1,45.72 5.59,45.21 4.57,45.21 2.79,46.99 2.79,50.8 2.79,51.05 2.79,51.17 R7.1
N$16  (via drill 0.35)
  Top 0.508: U2.5 8.04,26.44 v8.4,26.8
  Bottom 0.508: v8.4,26.8 13,26.8 R8.1 16.87,28.27 R9.1
N$23
  Bottom 0.254: IC3.3 14.06,52.16 15.31,53.41 15.31,55.24 14.8,55.75 Y2.1
N$24
  Bottom 0.254: IC3.2 11.72,52.8 11.43,53.09 11.43,53.81 12.54,54.92 12.54,56.64 11.13,58.05 Y2.3
N$25  (via drill 0.35)
  Top 0.584: U3.8 24,4.2 v24.2,4.4
  Bottom 0.584: v24.2,4.4 25.06,5.26 26,5.26 26.11,5.35 C15.2
N$26  (via drill 0.35)
  Bottom 0.508: v16.8,14.8 17.4,14.8 18.66,13.54 C13.2
  pour Top (no thermals): 20,9 20.6,9 20.6,11.2 20.9,11.5 20.9,15.1 20.4,15.6 12.3,15.6 10.9,14.2 10.9,14.1 13.3,11.7 18,11.7 18,14.4 18.3,14.7 19.7,14.7 20,14.4
N$27  (via drill 0.35)
  Top 0.508: v23,11.6 22.84,11.44 U3.1
  Bottom 0.508: v23,11.6 23,11.86 C13.1
N$28
  Top 0.508: C14.1 R1.1
N$29
  Top 0.508: U3.6 20.3,2.8 19.5,2 C14.2
N$30
  Top 0.508: R3.1 R2.1 18.83,4.4 U3.5
N$31
  Bottom 0.254: IC3.14 12.87,44.07 REXT.2
N$32  (via drill 0.35)
  Top 0.254: v24.4,37.6 Y1.P$1 25.03,38.57 25.8,37.8 C5.2
  Bottom 0.254: U1.2 23.63,39.77 24.4,39 v24.4,37.6
PB_BUCK_EN
  Top 0.508: U3.7 21.57,2.83 22.41,1.99 25.92,1.99 R24.2
RESET  (via drill 0.35)
  Top 0.254: J2.10 31.75,42.6 30.8,42.6 29.18,40.98 RRST1.1 28.22,40.98 26.1,43.1 24.1,43.1 23.4,42.4 21,42.4 19,40.4 v16.6,40.4
  Bottom 0.254: U1.40 16.43,40.57 v16.6,40.4
SCL  (via drill 0.35)
  Top 0.254: MCP9808.2 15.73,35.33 16.4,36 v16.4,37.6 15.5,38.5 R_I2C_1.2
  Bottom 0.254: U1.32 15.73,38.27 v16.4,37.6
SDA  (via drill 0.35)
  Top 0.254: MCP9808.1 14.98,35.98 15.4,36.4 15.4,37 v15.2,37.2 14.6,37.2 13.4,38.4 R_I2C_2.1
  Bottom 0.254: U1.31 14.63,37.77 v15.2,37.2
SWDCLK  (via drill 0.35)
  Top 0.254: J2.4 33.6,36.94 33.6,35.8 33,35.2 30,35.2 29,36.2 22.8,36.2 v19.4,39.6
  Bottom 0.254: U1.45 18.93,40.07 v19.4,39.6
SWDIO  (via drill 0.35)
  Top 0.254: J2.2 32.6,36.2 32.19,35.79 30.41,35.79 29.4,36.8 23.4,36.8 20.2,40 v20.2,40.2
  Bottom 0.254: U1.46 19.43,40.77 20,40.2 v20.2,40.2
UC_DM
  Bottom 0.254: IC3.10 11.61,47.68 10.92,46.99 10.92,39.9 12.05,38.77 U1.33
UC_DP
  Bottom 0.254: IC3.11 11.73,47.04 11.43,46.74 11.43,40.17 12.33,39.27 U1.34
USB0_EN  (via drill 0.35)
  Top 0.254: v8.58,40.89 8.64,40.95 8.64,54.25 8.23,54.66 5.8,54.66 5.45,55 AP2.3 5.42,55.63 R_MOSFET_USB6.2
  Bottom 0.254: v8.58,40.89 8.54,40.85 8.54,36.86 10.13,35.27 U1.26
USB1_EN  (via drill 0.35)
  Top 0.254: AP2553.3 16.93,51.2 R_MOSFET_USB3.2 15.2,51.2 15,51 15,48.4 11,44.4 v11,38.2
  Bottom 0.254: U1.30 11.93,37.27 v11,38.2
USB1_OUT
  pour Top (no thermals): 19.4,49.5 18.9,49.5 18.9,47.8 18,46.9 18,45.2 19.6,45.2 20.5,46.1 22.2,46.1 22.7,46.6 25.6,46.6 25.6,47.4 20.3,47.4 19.4,48.3
USB2_EN  (via drill 0.35)
  Top 0.254: AP1.3 18.39,60.26 R_MOSFET_USB4.2 15.77,56.2 11.8,56.2 10.92,55.32 v10.92,52.07
  Bottom 0.254: v10.92,52.07 11.12,51.87 11.12,48.71 9.93,47.52 9.93,37.67 11.33,36.27 U1.28
USB2_OUT  (via drill 0.35)
  Top 0.508: AP1.6 22.05,62.16 C20.2
  other vias: 22.98,55.57 23.74,55.57 24.5,55.57 24.5,56.33 23.74,56.33 22.98,56.33
  pour Bottom (no thermals): 25.57,53.54 22.47,53.54 22.47,56.84 25.01,56.84 25.01,54.1
  pour Top (no thermals): 22.47,55.06 25.01,55.06 25.01,57.35 27.3,59.64 27.3,61.41 22.47,61.41
USB_1_DM  (via drill 0.35)
  Top 0.254: USB_1.D- 21.99,49.5 21.39,48.9 20.7,48.9 v20.6,48.8
  Bottom 0.254: IC3.8 15.51,48.96 15.95,48.51 20.31,48.51 v20.6,48.8
USB_1_DP  (via drill 0.35)
  Top 0.254: USB_1.D+ 22.3,51.5 21,50.2 v21,50
  Bottom 0.254: IC3.9 12.93,48.26 15.24,48.26 15.69,47.81 20.7,47.81 21.6,48.71 21.6,49.4 v21,50
USB_2_DM
  Bottom 0.254: IC3.6 15.94,50.24 17.45,51.75 23.94,51.75 USB_2.D-
USB_2_DP
  Bottom 0.254: USB_2.D+ 23.1,49.5 21.6,51 17.8,51 16.4,49.6 IC3.7
VCC  (via drill 0.35)  (1 unrouted)
  Top 0.254: J2.1 29.02,38.98 RRST1.2 | v12.2,41.2 12.2,40.6 12.5,40.3 12.6,40.3 R_I2C_2.2 R_I2C_1.1 | v18.43,37 17.3,37 17,36.7 17,36.3 17.32,35.98 MCP9808.8
  Bottom 0.254: U1.44 18.43,39.6 | 18.43,37.8 v18.43,37 U1.17 18.43,31.64 C9.1 18.09,31 v11.2,31 | 18.43,37.8 18.43,39.6 | 18.43,37.8 18.46,37.77 U1.6 23.03,37.77 23.4,37.4 23.4,37 23.8,36.6 31.26,36.6 J2.1 | C1.1 19.01,43.57 18.43,42.99 U1.44 | 18.44,42.71 18.44,42.8 18.43,42.79 U1.44 | v12.2,41.2 12.2,40.6 12.51,40.29 14.63,40.29 15.32,39.6 18.43,39.6 | R11.2 11.5,31.8 10.8,31.8
  Bottom 1: IC1.3 7.88,31.09 C8.1
  other vias: 12,31
  pour Bottom (no thermals): 8.8,30.6 12.6,30.6 12.6,32 8.8,32
  pour Top (no thermals): 9.2,32 9.2,30.6 12.6,30.6 12.6,32
VCC_5V  (via drill 0.35)
  Top 0.508: AP1.1 17.45,62.16 C17.1
  Top 1: 9.65,55.76 11.3,57.4 15.2,57.4 16.08,58.28 C3.1 17.12,60.44 C17.1 | 9.65,51.2 9.85,51 10.05,50.8 11.6,50.8 14.64,53.84 C11.1
  Top 1.27: 9.85,51 v9.85,49.78 9.85,39.39 7.07,36.6 4,36.6 v1.4,34 v1.4,33.2 v1.4,32.3 v1.4,31.5 | 9.65,55.76 9.65,51.2
  Bottom 0.254: IC1.2@1 2.02,32.58 v1.4,33.2
  Bottom 0.381: IC3.20 8.69,48.32 9.85,49.48 v9.85,49.78
  Bottom 1.27: v1.6,14.4 1.4,14.6 v1.4,31.5 v1.4,32.3 v1.4,33.2 v1.4,34 3.6,34 4.11,34.51 C7.1
  other vias: 1.2,15.2 2,15.2 2.8,15.2 3.6,15.2 4.4,15.2 2.4,14.4 3.2,14.4 4,14.4
  pour Top (no thermals): 6,6.4 6,14.6 5,15.6 0.8,15.6 0.8,12.6 4.6,12.6 4.6,7.8
  pour Top (no thermals): 11.6,3.6 8.8,3.6 4.7,7.7 6,9 9.8,5.2 11.6,5.2
  pour Bottom: 0.6,13.8 4.8,13.8 4.8,15.6 0.6,15.6
  pour Top (no thermals): 7.4,60.2 7.4,58.2 7.6,58 7.6,56.9 7.1,56.4 7.1,55.1 10.3,55.1 10.3,57.1 9,58.4 9,60.2
  pour Top (no thermals): 21.3,54.3 17.7,54.3 17.7,53.4 18.5,53.4 18.9,53 18.9,50.9 19.9,50.9 21.3,52.3
VCC_8V2  (via drill 0.35)
  Top 0.508: L1.1 20.87,26.07 v22,27.2
  Bottom 0.508: v22,27.2 20.4,25.6 R9.2
  other vias: 33.4,18.5 33.4,17.8 34.2,17.8 34.2,18.5 34.2,17
  pour Top (no thermals): 20.2,28 18.9,26.7 23.4,22.2 25.4,22.2 26.2,23 30.8,23 31.4,22.4 31.4,18.9 33.7,16.6 35,16.6 35,22.2 32.2,25 23.2,25
  pour Bottom (no thermals): 33,16.6 35,16.6 35,21.2 33,21.2
VD_18  (via drill 0.35)  (1 unrouted)
  Top 0.254: v24.77,45.28 25.37,45.28 26.42,46.33 26.42,54.78 25.83,55.37 v25.73,55.37
  Bottom 0.254: IC3.28 7.45,57.49 9.4,59.44 24.09,59.44 25.73,57.8 v25.73,55.37 | 16.01,46.4 IC3.12 | C28.1 16.19,46 24.05,46 v24.77,45.28
VD_33  (via drill 0.35)
  Top 0.254: v25.01,43.83 25.07,43.83 27.37,46.14 v27.37,54.5
  Bottom 0.254: IC3.19 6.17,47.68 5.59,48.26 5.59,48.77 | IC3.13 13.93,45.76 14.26,45.43 23.41,45.43 v25.01,43.83 | 5.59,53.85 5.59,56.44 9.29,60.14 24.4,60.14 26.27,58.27 26.27,56 27.37,54.9 v27.37,54.5 | 5.59,53.85 5.59,52.07 | IC3.26 5.67,52.16 5.59,52.07 | R7.2 3.67,53.85 5.59,53.85 | 5.59,48.77 5.59,52.07 | IC3.21 6.05,48.96 | 6.05,48.96 C29.2 | 6.05,48.96 5.78,48.96 5.59,48.77
VD_INT  (via drill 0.35)
  Top 0.254: C6.1 21.59,34.56 20.2,35.95 v20.2,36.8
  Top 0.584: VD1.1 VD2.2 C6.1
  Bottom 0.254: U1.7 20.67,37.27 v20.2,36.8

### Text on the board
tPlace: TIME | BOX | 17
bPlace: OUT | IN